# Altium schematic sheet MCU.SchDoc
size A; SheetNumber: 1; SheetTotal: 1; SPICEModelCacheJLBYLVFO: <root> / <DocumentId>JLBYLVFO</DocumentId> / <CacheFrame Number="0"> / <Model Name="cap" Kind="MDL"> / <Text>*Default semiconductor capacitor / .MODEL CAP C()</Text> / </Model> / <Model Name="xtal" Kind="CKT"> / <Text>*Generic type:crystal pkg:HC33/51 / .SUBCKT XTAL 1 2 PARAMS: FREQ=1Meg RS=750 C=13pf Q=1000 / LX 1 3 {((Q*RS)/(6.2831852*FREQ))} IC=0.5M / CX 3 4 {(1/(Q*6.2831852*FREQ*RS))} / C0 1 2 {C} / RS 4 2 {RS} / .ENDS XTAL</Text> / </Model> / </CacheFrame> / </root>
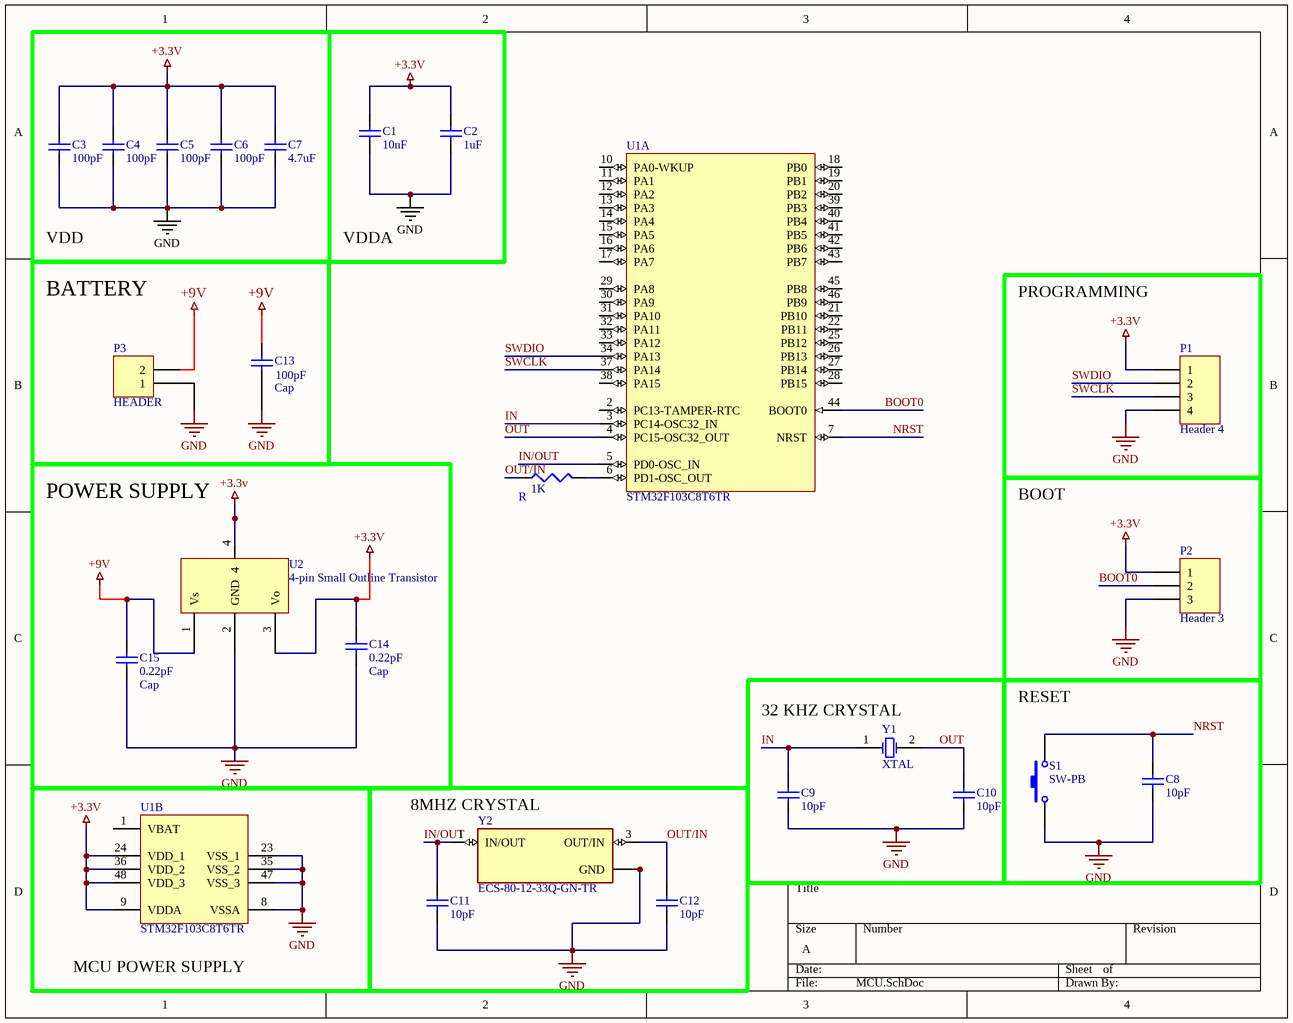
[diagram p0: MCU.SchDoc]

## Parts
C1  value 10nF  [1608[0603]]
C2  value 1uF  [1608[0603]]
C3  value 100pF  [1608[0603]]
C4  value 100pF  [1608[0603]]
C5  value 100pF  [1608[0603]]
C6  value 100pF  [1608[0603]]
C7  value 4.7uF  [1608[0603]]
C8  value 10pF  [1608[0603]]
C9  value 10pF  [1608[0603]]
C10  value 10pF  [1608[0603]]
C11  value 10pF  [1608[0603]]
C12  value 10pF  [1608[0603]]
C13  Cap  value 100pF  [RAD-0.3]
C14  Cap  value 0.22pF  [RAD-0.3]
C15  Cap  value 0.22pF  [RAD-0.3]
P1  Header 4  [HDR1X4]
P2  Header 3  [HDR1X3]
P3  HEADER  [MHDR1X2]
R  value 1K  [J1-0603]
S1  SW-PB  [SPST-2]
U1  STM32F103C8T6TR  [STM-LQFP48_M]  (parts A,B of 2)
U2  4-pin Small Outline Transistor  [PCBComponent_1]
Y1  XTAL  [R38]
Y2  ECS-80-12-33Q-GN-TR  [XTAL_ECS-80-12-33Q-GN-TR]

## Blocks framed on the sheet
BATTERY: C13 P3
PROGRAMMING: P1
POWER SUPPLY: C14 C15 U2
BOOT: P2
32 KHZ CRYSTAL: C9 C10 Y1
RESET: C8 S1
MCU POWER SUPPLY: U1
8MHZ CRYSTAL: C11 C12 Y2

## Nets
+3.3V: C1.2 C2.2 C3.2 C4.2 C5.2 C6.2 C7.2 C14.2 P1.1 P2.1 U1.9(VDDA) U1.24(VDD_1) U1.36(VDD_2) U1.48(VDD_3) U2.3(Vo) U2.4
+9V: C13.2 C15.2 P3.2 U2.1(Vs)
GND: C1.1 C2.1 C3.1 C4.1 C5.1 C6.1 C7.1 C8.1 C9.1 C10.1 C11.1 C12.1 C13.1 C14.1 C15.1 P1.4 P2.3 P3.1 S1.1 U1.8(VSSA) U1.23(VSS_1) U1.35(VSS_2) U1.47(VSS_3) U2.2(GND) Y2.2(GND) Y2.4(GND)
BOOT0: P2.2 U1.44(BOOT0)
IN: C9.2 U1.3(PC14-OSC32_IN) Y1.1(OSC1)
IN/OUT: C11.2 U1.5(PD0-OSC_IN) Y2.1(IN/OUT)
NRST: C8.2 S1.2 U1.7(NRST)
OUT: C10.2 U1.4(PC15-OSC32_OUT) Y1.2(OSC2)
OUT/IN: C12.2 R.1 Y2.3(OUT/IN)
SWCLK: P1.3 U1.37(PA14)
SWDIO: P1.2 U1.34(PA13)
NetR_2: R.2 U1.6(PD1-OSC_OUT)

Not connected (* = marked no-connect by the designer): U1 1(VBAT) 2(PC13-TAMPER-RTC) 10(PA0-WKUP) 11(PA1) 12(PA2) 13(PA3) 14(PA4) 15(PA5) 16(PA6) 17(PA7) 18(PB0) 19(PB1) 20(PB2) 21(PB10) 22(PB11) 25(PB12) 26(PB13) 27(PB14) 28(PB15) 29(PA8) 30(PA9) 31(PA10) 32(PA11) 33(PA12) 38(PA15) 39(PB3) 40(PB4) 41(PB5) 42(PB6) 43(PB7) 45(PB8) 46(PB9)

## Notes on the sheet
- VDD
- VDDA

## Library data of the parts
C1-C12 = Cap Semi: Capacitor (Semiconductor SIM Model); Published: 8-Jun-2000; LatestRevisionDate: 29-May-2009; LatestRevisionNote: IPC-7351 Footprint Added.; PackageReference: C1206; Publisher: Altium Limited; PackageDescription: Chip Capacitor
C13-C15 = Cap: Capacitor; Published: 8-Jun-2000; LatestRevisionDate: 17-Jul-2002; LatestRevisionNote: Re-released for DXP Platform.; PackageReference: RAD-0.3; Publisher: Altium Limited; PackageDescription: Radial Cap, Thru-Hole; 2 Leads; 0.3 in Pin Spacing
P1 = Header 4: Header, 4-Pin; LatestRevisionDate: 17-Jul-2002; LatestRevisionNote: Re-released for DXP Platform.; Publisher: Altium Limited
P2 = Header 3: Header, 3-Pin; LatestRevisionDate: 17-Jul-2002; LatestRevisionNote: Re-released for DXP Platform.; Publisher: Altium Limited
P3 = MHDR1X2: Header, 2-Pin; LatestRevisionDate: 17-Jul-2002; LatestRevisionNote: Re-released for DXP Platform.; Publisher: Altium Limited
R = Res3: Resistor; Published: 8-Jun-2000; LatestRevisionDate: 29-May-2009; LatestRevisionNote: IPC-7351 Footprint Added.; PackageReference: J1-0603; Publisher: Altium Limited; PackageDescription: Chip Resistor
S1 = SW-PB: Switch; Published: 24-Mar-1999; LatestRevisionDate: 17-Jul-2002; LatestRevisionNote: Re-released for DXP Platform.; PackageReference: SPST-2; Publisher: Altium Limited; PackageDescription: Switch; 2 Leads
U1 = STM32F103C8T6TR: ARM Cortex-M3 32-bit MCU, 64 KB Flash, 20 KB Internal RAM, 37 I/Os, 48-pin LQFP, -40 to 85 degC, Tape and Reel; A/D Converter: 2x12-bit (10 Channel); FLASH Size (Prog) (kB): 64; I/Os (High Current): 37; Internal RAM Size (kB): 20; Operating Frequency(F) (Processor speed) (MHz): 72; Supply Voltage(Vcc) min (V): 2; DatasheetVersion: Rev. 16; PackageVersion: Rev. 6, 06/2013; PackageReference: LQFP48; PackageDescription: 48-Pin Low Profile Quad Flat Package, 7 x 7 mm Body, 0.5 mm Pitch; Supplier 1: Digi-Key; Supplier Part Number 1: STM32F103C8T6TR-ND; Supplier 2: Mouser; Supplier Part Number 2: 511-STM32F103C8T6TR; Core: ARM Cortex-M3; Packing: Tape and Reel; Mounting Technology: Surface Mount; PartNumber: STM32F103C8T6TR; ComponentLink1Description: Manufacturer URL; ComponentLink1URL: http://www.st.com/web/en/home.html; ComponentLink2Description: Datasheet; ComponentLink2URL: http://www.st.com/st-web-ui/static/active/en/resource/technical/document/datasheet/CD00161566.pdf; ComponentLink3Description: Package Specification; ComponentLink3URL: http://www.st.com/st-web-ui/static/active/en/resource/technical/document/datasheet/DM00058181.pdf
U2 = 4 pin regulator: SOT packages encompass a broad variety of semiconductor devices, from RF transistors to diodes and resistor networks. The internal circuitry and pinout (e.g., Collector, Base, Emitter, or Gate, Source, Drain) are entirely dependent on the specific component's part number; OUTPUT VOLTAGE: 5V; ComponentLink1Description: SOT; ComponentLink1URL: https://www.google.com/goto?url=CAESjQEB7keqTX21ZOXNSpJkU3nIPEZw5J1l-B0AOhE7hnM8zeDuRhMH6c0VO7DRYQgU-e_kM-rxIGJRcI8ohvQgYs9vUwDX9_FxT9AIWl4K4bJIas8wyqcdTol44_EUUZOEBLTMta97InY6-2C_v4u3Vpsftajw6wq5LVStmcljtgGhP31RZyHKLZ6lr37DgZs=
Y1 = XTAL: Crystal Oscillator; Published: 8-Jun-2000; LatestRevisionDate: 17-Jul-2002; LatestRevisionNote: Re-released for DXP Platform.; PackageReference: R38; Publisher: Altium Limited; PackageDescription: Crystal, Thru-Hole; 2 Leads; Body 3.1 x 8.2 mm (Dia.xH)
Y2 = ECS-80-12-33Q-GN-TR: MF: ECS Inc.; Package: None; Price: None; Value: *; MP: ECS-80-12-33Q-GN-TR; Availability: Unavailable